# EAGLE design carry-select (EAGLE 7.6.0)
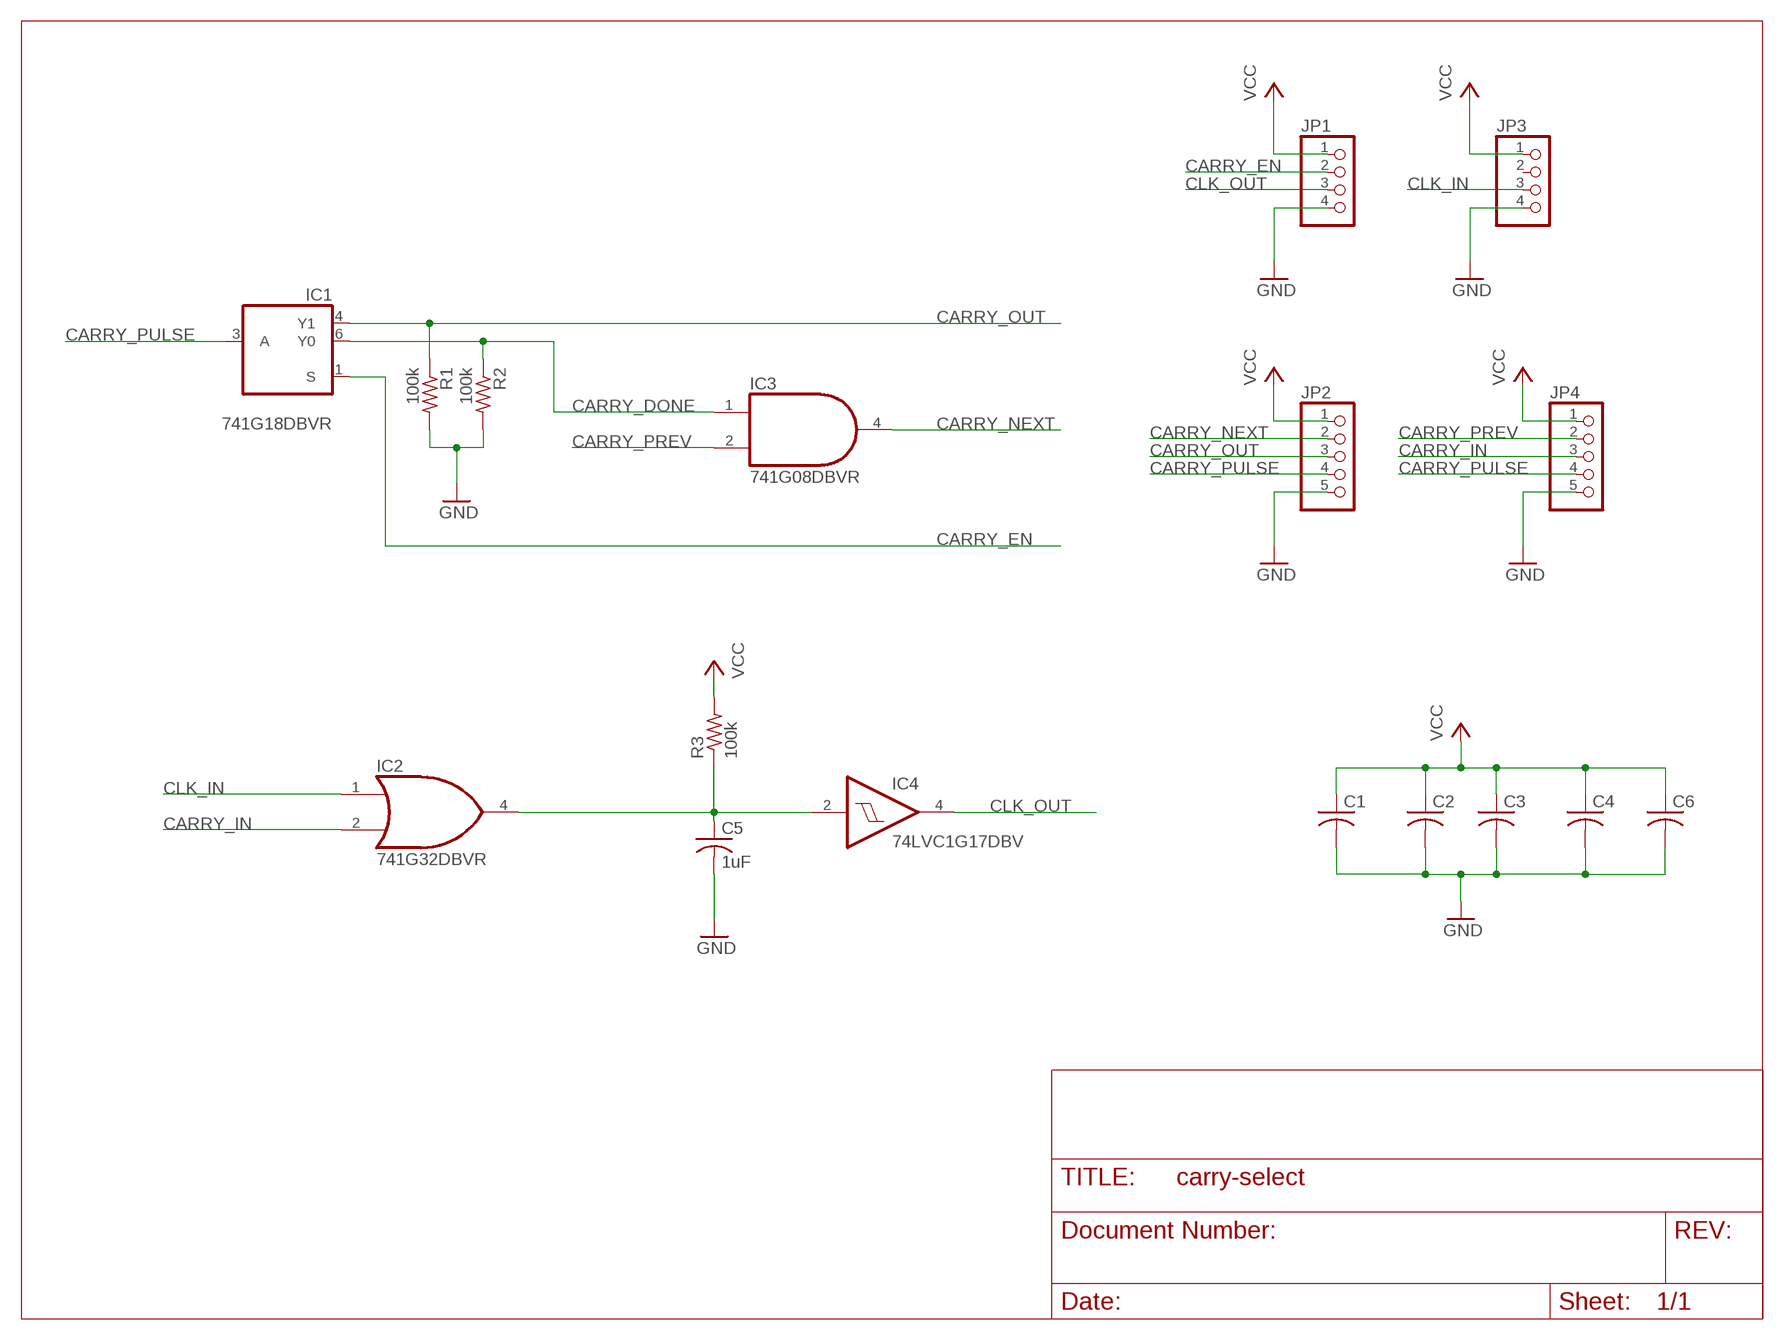
[diagram p0: schematic, sheet 1]

## Parts
C1  C-USC0603K  [C0603K]
C2  C-USC0603K  [C0603K]
C3  C-USC0603K  [C0603K]
C4  C-USC0603K  [C0603K]
C5  1uF  C-USC0603K  [C0603K]
C6  C-USC0603K  [C0603K]
IC1  741G18DBVR  741G18  [DBV_R-PDSO-G6]
IC2  741G32DBVR  74AHC1G32DBV  [SOT23-5]
IC3  741G08DBVR  74LVC1G08DBV  [SOT23-5]
IC4  74LVC1G17DBV  [SOT23-5]
JP1  PINHD-1X4  [1X04]
JP2  PINHD-1X5  [1X05]
JP3  PINHD-1X4  [1X04]
JP4  PINHD-1X5  [1X05]
R1  100k  R-US_R0603  [R0603]
R2  100k  R-US_R0603  [R0603]
R3  100k  R-US_R0603  [R0603]

## Nets
CARRY_DONE: IC1.6(Y0) IC3.1(I0) R2.1
CARRY_EN: IC1.1(S) JP1.2
CARRY_IN: IC2.2(I1) JP4.3
CARRY_NEXT: IC3.4(O) JP2.2
CARRY_OUT: IC1.4(Y1) JP2.3 R1.1
CARRY_PREV: IC3.2(I1) JP4.2
CARRY_PULSE: IC1.3(A) JP2.4 JP4.4
CLK_IN: IC2.1(I0) JP3.3
CLK_OUT: IC4.4(O) JP1.3
GND: C1.2 C2.2 C3.2 C4.2 C5.2 C6.2 JP1.4 JP2.5 JP3.4 JP4.5 R1.2 R2.2
PRE_CLK: C5.1 IC2.4(O) IC4.2(I) R3.1
VCC: C1.1 C2.1 C3.1 C4.1 C6.1 JP1.1 JP2.1 JP3.1 JP4.1 R3.2
Unconnected: JP3.2

## Power pins joined to a net without a drawn wire
GND: IC1.2(GND) IC2.3(GND) IC3.3(GND) IC4.3(GND)
VCC: IC1.5(VCC) IC2.5(VCC) IC3.5(VCC) IC4.5(VCC)

## Library data of the parts
C1-C6 = resistor:C-US: CAPACITOR, American symbol
IC1 = 74xx-little-us:74*1G18: 1-OF-2 NONINVERTING DEMULTIPLEXER WITH 3-STATE DESELECTED OUTPUT
IC2 = 74xx-little-us:74*1G32: 2-input OR gate
IC3 = 74xx-little-us:74*1G08: 2-input AND gate
IC4 = 74xx-little-us:74*1G17: Single Schmitt-Trigger Buffer
JP1 JP3 = pinhead:PINHD-1X4: PIN HEADER
JP2 JP4 = pinhead:PINHD-1X5: PIN HEADER
R1-R3 = resistor:R-US_: RESISTOR, American symbol

## Board
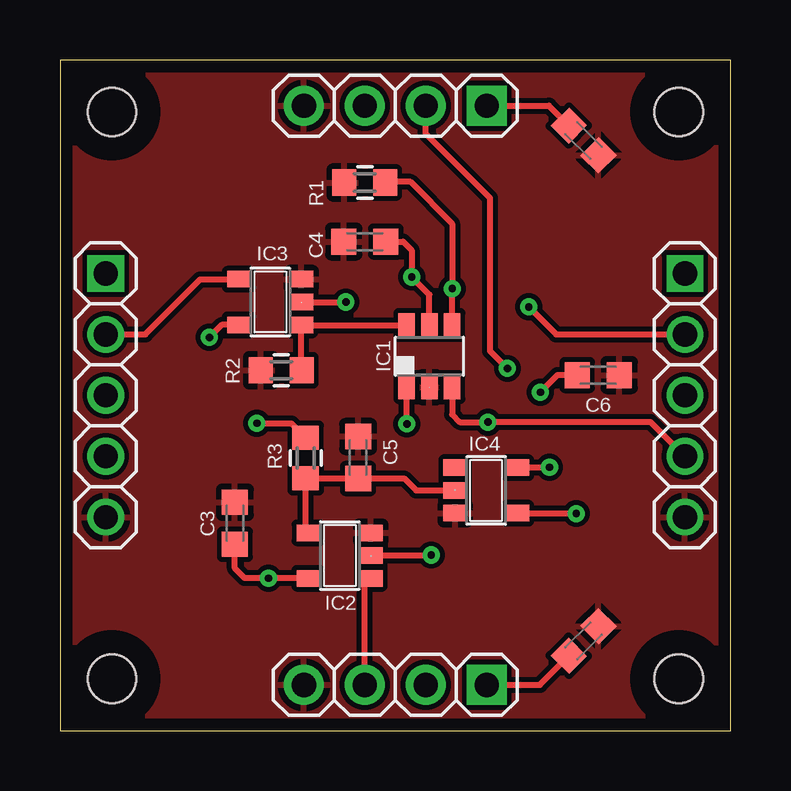
[diagram p1: board, top side]
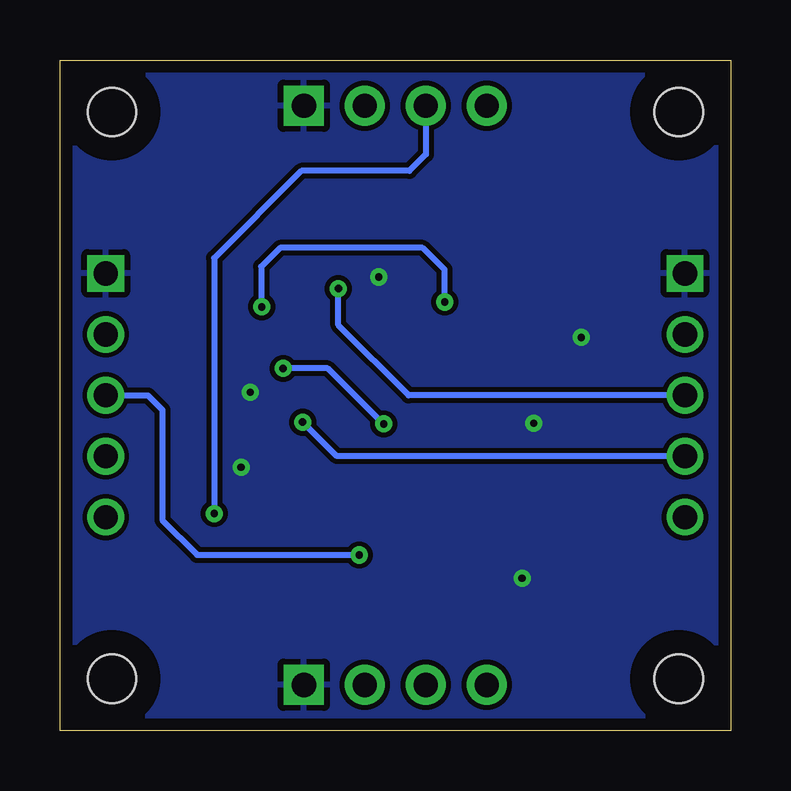
[diagram p2: board, bottom side, seen from below]

Size 27.94 x 27.94 mm. Coordinates in mm from the lower left corner, seen from the top.
Outline: 27.94,27.94 0,27.94 0,0 27.94,0 27.94,27.94
Copper layers (1*16): Top 0.035mm / dielectric 1.5mm / Bottom 0.035mm
Design rules "default *": minimum track width 8mil, minimum drill 12mil, track to track 8mil, track to pad 8mil, pad to pad 8mil, via to via 8mil, smd to smd 8mil, copper to edge 20mil, drill to drill 8mil, minimum pad ring 10mil, minimum via ring 8mil, stop-mask expansion 4mil, vias tented up to drill 0mil, thermal gap 10mil
Holes 2.01 mm at 2.16,2.16 25.78,2.16 25.78,25.78 2.16,25.78
tRestrict: area 23.8,0.2 to 27.8,4.2; area 23.8,23.8 to 27.8,27.8; area 0.2,23.8 to 4.2,27.8; area 0.2,0.2 to 4.2,4.2
bRestrict: area 23.8,0.2 to 27.8,4.2; area 23.8,23.8 to 27.8,27.8; area 0.2,23.8 to 4.2,27.8; area 0.2,0.2 to 4.2,4.2

### Footprints (pad centres in the part's own frame; a part is rotated, then mirrored left to right if it is on the bottom)
C0603K = smd 1.05 x 1.08: 1 -0.875,0; 2 0.875,0
DBV_R-PDSO-G6 = smd 0.69 x 0.99: 1 -0.95,-1.29; 2 0,-1.29; 3 0.95,-1.29; 4 0.95,1.3; 5 0,1.3; 6 -0.95,1.3
SOT23-5 = smd 0.69 x 0.99: 1 -0.95,-1.29; 2 0,-1.29; 3 0.95,-1.29; 4 0.95,1.3; 5 -0.95,1.3
1X04 = drill 1.016 pad 1.676 square: 1 -3.81,0 | drill 1.016 pad 1.676: 2 -1.27,0; 3 1.27,0; 4 3.81,0
1X05 = drill 1.016 square: 1 -5.08,0 | drill 1.016: 2 -2.54,0; 3 0,0; 4 2.54,0; 5 5.08,0
R0603 = smd 1 x 1.1: 1 -0.85,0; 2 0.85,0

### Placement (x,y rotation side)
C1  21.82,3.73 45 top
C2  21.82,24.59 315 top
C3  7.29,8.64 90 top
C4  12.7,20.37 180 top
C5  12.42,11.38 90 top
C6  22.43,14.81 0 top
IC1  15.39,15.6 0 top
IC2  11.66,7.29 90 top
IC3  8.76,17.86 90 top
IC4  17.75,10.01 270 top
JP1  13.97,26.04 180 top
JP2  1.91,13.97 270 top
JP3  13.97,1.91 180 top
JP4  26.04,13.97 270 top
R1  12.7,22.83 180 top
R2  9.22,15.01 180 top
R3  10.24,11.35 90 top

### Tracks (layer width: path | path; a pad name or v marks a point on that pad's centre or on a via)
CARRY_DONE
  Top 0.254: R2.1 10.05,15.03 IC3.1 10.06,16.9 IC1.6
CARRY_EN  (via drill 0.3)
  Top 0.254: v18.64,15.09 17.91,15.82 17.91,22.2 16.99,23.11 15.24,24.87 JP1.2 | v14.45,12.78 v14.44,12.79 IC1.1
  Bottom 0.254: v14.45,12.78 14.48,12.78 16.79,15.09 v18.64,15.09
CARRY_IN  (via drill 0.3)
  Top 0.254: v15.47,7.32 15.44,7.29 IC2.2
  Bottom 0.254: JP4.3 24.28,13.97 23.67,13.36 23.67,8.76 22.23,7.32 v15.47,7.32
CARRY_NEXT
  Top 0.254: JP2.2 3.56,16.51 5.84,18.8 7.45,18.8 IC3.4
CARRY_OUT  (via drill 0.3)
  Top 0.254: IC1.4 v16.34,18.41 16.34,21.12 14.61,22.86 13.57,22.86 R1.1
  Bottom 0.254: JP2.3 13.42,13.97 IC1.4 v16.34,18.41
CARRY_PREV  (via drill 0.3)
  Top 0.254: IC3.2 v11.91,17.86 | v19.53,17.65 20.68,16.51 JP4.2
  Bottom 0.254: v19.53,17.65 19.56,17.68 19.56,19.33 18.77,20.12 12.83,20.12 11.91,19.2 v11.91,17.86
CARRY_PULSE  (via drill 0.3)
  Top 0.254: JP4.4 24.61,12.85 v17.83,12.85 16.66,12.85 16.34,13.17 IC1.3
  Bottom 0.254: JP2.4 16.41,11.43 v17.83,12.85
CLK_IN
  Top 0.254: JP3.3 12.7,6.09 IC2.1
CLK_OUT  (via drill 0.3)
  Top 0.254: IC4.4 21.5,9.06 v21.51,9.04
  Bottom 0.254: JP1.3 12.7,24 13.39,23.32 17.88,23.32 21.51,19.68 v21.51,9.04
GND
  pour Top: 27.69,0.25 0.25,0.25 0.25,27.69 27.69,27.69
PRE_CLK
  Top 0.254: 16.4,10.07 IC4.2 14.83,10.01 14.34,10.5 C5.1 R3.1 10.24,8.36 IC2.4
VCC  (via drill 0.3)
  Top 0.254: IC3.5 6.75,16.91 v6.22,16.38 | IC1.5 15.39,18.16 v14.66,18.9 14.66,20.02 14.3,20.37 C4.1 | IC2.5 v8.7,6.34 v8.69,6.35 7.7,6.35 7.29,6.76 C3.1 | JP3.1 19.99,1.91 C1.1 | JP1.1 20.37,26.04 C2.1 | IC4.5 19.07,10.97 v20.4,10.97 | v8.2,12.8 9.64,12.8 R3.2 | C6.1 20.73,14.81 v20.02,14.1
  pour Bottom: 27.69,0.25 0.25,0.25 0.25,27.69 27.69,27.69

### Text on the board
Document: CARRY / SELECT